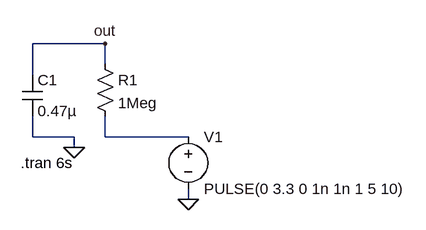
[diagram p0: schematic Draft3.asc]
Draft3.asc, the LTspice schematic file:
Version 4
SHEET 1 880 680
WIRE 288 112 176 112
WIRE 288 144 288 112
WIRE 176 160 176 112
WIRE 176 256 176 224
WIRE 240 256 176 256
WIRE 288 256 288 224
WIRE 416 256 288 256
WIRE 240 272 240 256
WIRE 416 352 416 336
FLAG 240 272 0
FLAG 288 112 out
FLAG 416 352 0
SYMBOL cap 160 160 R0
SYMATTR InstName C1
SYMATTR Value 0.47µ
SYMBOL res 272 128 R0
SYMATTR InstName R1
SYMATTR Value 1Meg
SYMBOL voltage 416 240 R0
WINDOW 123 0 0 Left 0
WINDOW 39 0 0 Left 0
SYMATTR InstName V1
SYMATTR Value PULSE(0 3.3 0 1n 1n 1 5 10)
TEXT 158 296 Left 2 !.tran 6s

The netlist it stands for:
* Draft3.asc
C1 out 0 0.47µ
R1 out N001 1Meg
V1 N001 0 PULSE(0 3.3 0 1n 1n 1 5 10)
.tran 6s
.backanno
.end